# EAGLE schematic coolrunner_bob (EAGLE 6.4)
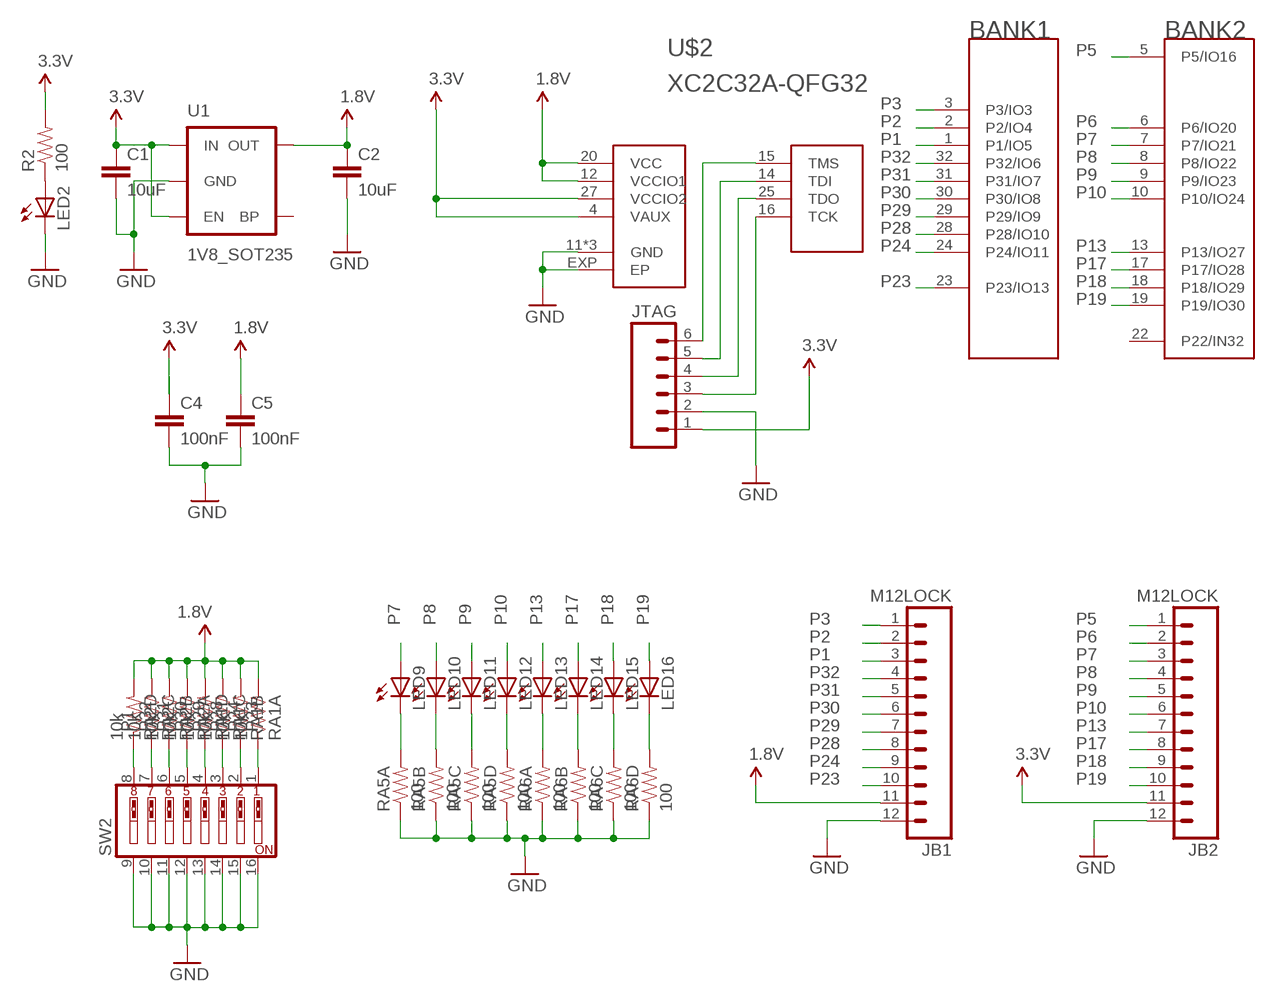
[diagram p0: schematic, sheet 1]

## Parts
C1  10uF  CAP0805  [0805]
C2  10uF  CAP0805  [0805]
C4  100nF  CAP0402-CAP  [0402-CAP]
C5  100nF  CAP0402-CAP  [0402-CAP]
JB1  M12LOCK  [1X12_LOCK]
JB2  M12LOCK  [1X12_LOCK]
JTAG  M06LOCK  [1X06_LOCK]
LED2  LED0603  [LED-0603]
LED9  LED0603  [LED-0603]
LED10  LED0603  [LED-0603]
LED11  LED0603  [LED-0603]
LED12  LED0603  [LED-0603]
LED13  LED0603  [LED-0603]
LED14  LED0603  [LED-0603]
LED15  LED0603  [LED-0603]
LED16  LED0603  [LED-0603]
R2  100  RESISTOR0603-RES  [0603-RES]
RA1  10k  RESISTOR_ARRAY0603_X4  [0603-ARV]
RA2  10k  RESISTOR_ARRAY0603_X4  [0603-ARV]
RA5  100  RESISTOR_ARRAY0603_X4  [0603-ARV]
RA6  100  RESISTOR_ARRAY0603_X4  [0603-ARV]
SW2  SW_DIP-8  [DIPSWITCH-08]
U1  1V8_SOT235  V_REG_LDOSMD  [SOT23-5]
U$2  XC2C32A-QFG32  [QFN32-5X5]

## Nets
1.8V: C2.1 C5.1 JB1.11 RA1.5 RA1.6 RA1.7 RA1.8 RA2.5 RA2.6 RA2.7 RA2.8 U1.5(OUT) U$2.12(VCCIO1) U$2.20(VCC)
3.3V: C1.1 C4.1 JB2.11 JTAG.1 R2.2 U1.1(IN) U1.3(EN) U$2.4(VAUX) U$2.27(VCCIO2)
GND: C1.2 C2.2 C4.2 C5.2 JB1.12 JB2.12 JTAG.2 LED2.C RA5.1 RA5.2 RA5.3 RA5.4 RA6.1 RA6.2 RA6.3 RA6.4 SW2.9 SW2.10 SW2.11 SW2.12 SW2.13 SW2.14 SW2.15 SW2.16 U1.2(GND) U$2.11(GND) U$2.21(GND) U$2.26(GND) U$2.EXP(EP)
N$2: LED2.A R2.1
N$13: LED16.C RA6.5
N$14: LED15.C RA6.6
N$15: LED14.C RA6.7
N$16: LED13.C RA6.8
N$17: LED12.C RA5.5
N$18: LED11.C RA5.6
N$19: LED10.C RA5.7
N$20: LED9.C RA5.8
P1: JB1.3 RA2.4 SW2.8 U$2.1(P1/IO5)
P2: JB1.2 U$2.2(P2/IO4)
P3: JB1.1 U$2.3(P3/IO3)
P5: JB2.1 U$2.5(P5/IO16)
P6: JB2.2 U$2.6(P6/IO20)
P7: JB2.3 LED9.A U$2.7(P7/IO21)
P8: JB2.4 LED10.A U$2.8(P8/IO22)
P9: JB2.5 LED11.A U$2.9(P9/IO23)
P10: JB2.6 LED12.A U$2.10(P10/IO24)
P13: JB2.7 LED13.A U$2.13(P13/IO27)
P17: JB2.8 LED14.A U$2.17(P17/IO28)
P18: JB2.9 LED15.A U$2.18(P18/IO29)
P19: JB2.10 LED16.A U$2.19(P19/IO30)
P23: JB1.10 RA1.1 SW2.1 U$2.23(P23/IO13)
P24: JB1.9 RA1.2 SW2.2 U$2.24(P24/IO11)
P28: JB1.8 RA1.3 SW2.3 U$2.28(P28/IO10)
P29: JB1.7 RA1.4 SW2.4 U$2.29(P29/IO9)
P30: JB1.6 RA2.1 SW2.5 U$2.30(P30/IO8)
P31: JB1.5 RA2.2 SW2.6 U$2.31(P31/IO7)
P32: JB1.4 RA2.3 SW2.7 U$2.32(P32/IO6)
TCK: JTAG.3 U$2.16(TCK)
TDI: JTAG.5 U$2.14(TDI)
TDO: JTAG.4 U$2.25(TDO)
TMS: JTAG.6 U$2.15(TMS)
Unconnected: U1.4(BP) U$2.22(P22/IN32)

## Library data of the parts
C1 C2 C4 C5 = SparkFun-Capacitors:CAP: Capacitor Standard 0603 ceramic capacitor, and 0.1" leaded capacitor.
JB1 JB2 = SparkFun-Connectors:M12: Header 12 Standard 12-pin 0.1" header. Use with straight break away headers (SKU : PRT-00116), right angle break away headers (PRT-00553), swiss pins (PRT-00743), machine pins (PRT-00117), and female headers (PRT-00115).
JTAG = SparkFun-Connectors:M06: Header 6 Standard 6-pin 0.1" header. Use with straight break away headers (SKU : PRT-00116), right angle break away headers (PRT-00553), swiss pins (PRT-00743), machine pins (PRT-00117), and female headers (PRT-00115). Molex polarized connector foot print use with SKU : PRT-08094 with associated crimp pins and housings. NOTES ON THE VARIANTS LOCK and LOCK_LONGPADS... This footprint was designed to help hold the alignment of a through-hole component (i.e. 6-pin header) while soldering it into place. You may notice that each hole has been shifted either up or down by 0.005 of an inch from it's more standard position (which is a perfectly straight line). This slight alteration caused the pins (the squares in the middle) to touch the edges of the holes. Because they are alternating, it causes a "brace" to hold the component in place. 0.005 has proven to be the perfect amount of "off-center" position when using our standard breakaway headers. Although looks a little odd when you look at the bare footprint, once you have a header in there, the alteration is very hard to notice. Also,if you push a header all the way into place, it is covered up entirely on the bottom side. This idea of altering the position of holes to aid alignment will be further integrated into the Sparkfun Library for other footprints. It can help hold any component with 3 or more connection pins.
LED2 LED9-LED16 = SparkFun-LED:LED: LEDs Standard schematic elements and footprints for 5mm, 3mm, 1206, and 0603 sized LEDs. 5mm - Spark Fun Electronics SKU : COM-00529 (and others)
R2 = kmod:RESISTOR: Resistor Basic schematic elements and footprints for 0603, 1206, and PTH resistors.
RA1 RA2 RA5 RA6 = kmod:RESISTOR_ARRAY
SW2 = SparkFun-Electromechanical:SW_DIP-8: DIP Switch 8 Position Spark Fun Electronics SKU : COM-08034
U1 = SparkFun-PowerIC:V_REG_LDO: Voltage Regulator LDO Standard 150mA LDO voltage regulator in SOT-23 layout. Micrel part MIC5205. BP (by-pass) pin is used to lower output noise with 470pF cap.
U$2 = kmod:XC2C32A-QFG32